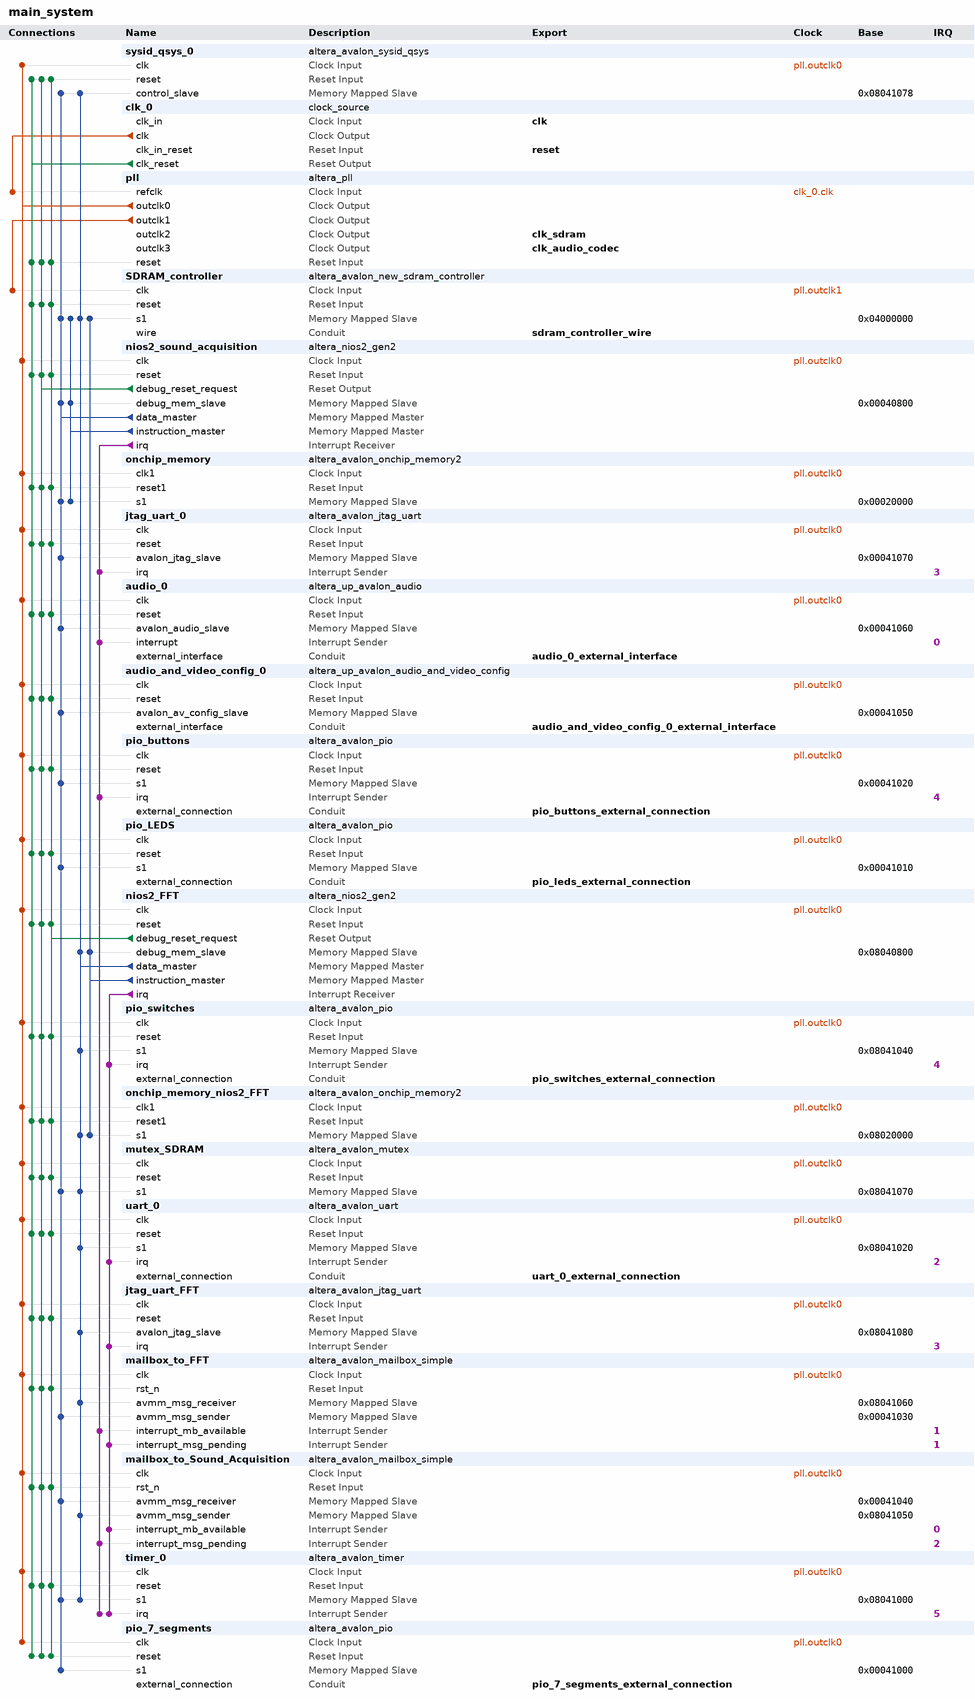
[diagram p0: system contents]
# Platform Designer (Qsys) system main_system, Cyclone V 5CSEMA5F31C6
# Parameters at their usual value, and those the tool derives, are not listed.
package require -exact qsys 18.0
create_system main_system
set_project_property DEVICE_FAMILY {Cyclone V}
set_project_property DEVICE 5CSEMA5F31C6

add_instance sysid_qsys_0 altera_avalon_sysid_qsys 18.0
set_instance_parameter_value sysid_qsys_0 id 0

add_instance clk_0 clock_source 18.0
set_instance_parameter_value clk_0 clockFrequency 50000000

add_instance pll altera_pll 18.0
set_instance_parameter_value pll gui_device_speed_grade 1
set_instance_parameter_value pll gui_number_of_clocks 4
set_instance_parameter_value pll gui_operation_mode normal
set_instance_parameter_value pll gui_output_clock_frequency0 50.0
set_instance_parameter_value pll gui_output_clock_frequency1 100.0
set_instance_parameter_value pll gui_output_clock_frequency2 100.0
set_instance_parameter_value pll gui_output_clock_frequency3 12.288
set_instance_parameter_value pll gui_phase_shift2 -3758
set_instance_parameter_value pll gui_pll_mode {Integer-N PLL}
set_instance_parameter_value pll gui_reference_clock_frequency 50.0
set_instance_parameter_value pll gui_use_locked false

add_instance SDRAM_controller altera_avalon_new_sdram_controller 18.0
set_instance_parameter_value SDRAM_controller TAC 5.4
set_instance_parameter_value SDRAM_controller TRCD 15.0
set_instance_parameter_value SDRAM_controller TRP 15.0
set_instance_parameter_value SDRAM_controller casLatency 3
set_instance_parameter_value SDRAM_controller columnWidth 10
set_instance_parameter_value SDRAM_controller dataWidth 16
set_instance_parameter_value SDRAM_controller generateSimulationModel false
set_instance_parameter_value SDRAM_controller model single_Micron_MT48LC4M32B2_7_chip
set_instance_parameter_value SDRAM_controller numberOfBanks 4
set_instance_parameter_value SDRAM_controller numberOfChipSelects 1
set_instance_parameter_value SDRAM_controller powerUpDelay 100.0
set_instance_parameter_value SDRAM_controller refreshPeriod 7.8125
set_instance_parameter_value SDRAM_controller rowWidth 13

add_instance nios2_sound_acquisition altera_nios2_gen2 18.0
set_instance_parameter_value nios2_sound_acquisition dcache_size 2048
set_instance_parameter_value nios2_sound_acquisition exceptionSlave onchip_memory.s1
set_instance_parameter_value nios2_sound_acquisition icache_size 4096
set_instance_parameter_value nios2_sound_acquisition impl Fast
set_instance_parameter_value nios2_sound_acquisition resetSlave onchip_memory.s1

add_instance onchip_memory altera_avalon_onchip_memory2 18.0
set_instance_parameter_value onchip_memory dataWidth 32
set_instance_parameter_value onchip_memory dualPort false
set_instance_parameter_value onchip_memory initMemContent true
set_instance_parameter_value onchip_memory initializationFileName onchip_mem.hex
set_instance_parameter_value onchip_memory memorySize 131072

add_instance jtag_uart_0 altera_avalon_jtag_uart 18.0
set_instance_parameter_value jtag_uart_0 simInteractiveOptions NO_INTERACTIVE_WINDOWS

add_instance audio_0 altera_up_avalon_audio 18.0
set_instance_parameter_value audio_0 audio_in true
set_instance_parameter_value audio_0 avalon_bus_type {Memory Mapped}
set_instance_parameter_value audio_0 dw 32

add_instance audio_and_video_config_0 altera_up_avalon_audio_and_video_config 18.0
set_instance_parameter_value audio_and_video_config_0 audio_in {Microphone to ADC}
set_instance_parameter_value audio_and_video_config_0 bit_length 32
set_instance_parameter_value audio_and_video_config_0 board DE1-SoC
set_instance_parameter_value audio_and_video_config_0 line_in_bypass false
set_instance_parameter_value audio_and_video_config_0 sampling_rate {48 kHz}

add_instance pio_buttons altera_avalon_pio 18.0
set_instance_parameter_value pio_buttons captureEdge true
set_instance_parameter_value pio_buttons direction Input
set_instance_parameter_value pio_buttons edgeType ANY
set_instance_parameter_value pio_buttons generateIRQ true
set_instance_parameter_value pio_buttons irqType EDGE
set_instance_parameter_value pio_buttons width 4

add_instance pio_LEDS altera_avalon_pio 18.0
set_instance_parameter_value pio_LEDS direction Output
set_instance_parameter_value pio_LEDS width 10

add_instance nios2_FFT altera_nios2_gen2 18.0
set_instance_parameter_value nios2_FFT dcache_size 2048
set_instance_parameter_value nios2_FFT exceptionSlave onchip_memory_nios2_FFT.s1
set_instance_parameter_value nios2_FFT icache_size 4096
set_instance_parameter_value nios2_FFT impl Fast
set_instance_parameter_value nios2_FFT resetSlave onchip_memory_nios2_FFT.s1

add_instance pio_switches altera_avalon_pio 18.0
set_instance_parameter_value pio_switches captureEdge true
set_instance_parameter_value pio_switches direction Input
set_instance_parameter_value pio_switches edgeType ANY
set_instance_parameter_value pio_switches generateIRQ true
set_instance_parameter_value pio_switches irqType EDGE
set_instance_parameter_value pio_switches width 10

add_instance onchip_memory_nios2_FFT altera_avalon_onchip_memory2 18.0
set_instance_parameter_value onchip_memory_nios2_FFT dataWidth 32
set_instance_parameter_value onchip_memory_nios2_FFT dualPort false
set_instance_parameter_value onchip_memory_nios2_FFT initMemContent true
set_instance_parameter_value onchip_memory_nios2_FFT initializationFileName onchip_mem.hex
set_instance_parameter_value onchip_memory_nios2_FFT memorySize 131072

add_instance mutex_SDRAM altera_avalon_mutex 18.0

add_instance uart_0 altera_avalon_uart 18.0
set_instance_parameter_value uart_0 baud 115200
set_instance_parameter_value uart_0 dataBits 8
set_instance_parameter_value uart_0 fixedBaud true
set_instance_parameter_value uart_0 parity NONE
set_instance_parameter_value uart_0 stopBits 1

add_instance jtag_uart_FFT altera_avalon_jtag_uart 18.0
set_instance_parameter_value jtag_uart_FFT simInteractiveOptions NO_INTERACTIVE_WINDOWS

add_instance mailbox_to_FFT altera_avalon_mailbox_simple 18.0
set_instance_parameter_value mailbox_to_FFT AWIDTH 2
set_instance_parameter_value mailbox_to_FFT DWIDTH 32
set_instance_parameter_value mailbox_to_FFT MSG_ARRIVAL_NOTIFY 1
set_instance_parameter_value mailbox_to_FFT MSG_SPACE_NOTIFY 1

add_instance mailbox_to_Sound_Acquisition altera_avalon_mailbox_simple 18.0
set_instance_parameter_value mailbox_to_Sound_Acquisition AWIDTH 2
set_instance_parameter_value mailbox_to_Sound_Acquisition DWIDTH 32
set_instance_parameter_value mailbox_to_Sound_Acquisition MSG_ARRIVAL_NOTIFY 1
set_instance_parameter_value mailbox_to_Sound_Acquisition MSG_SPACE_NOTIFY 1

add_instance timer_0 altera_avalon_timer 18.0
set_instance_parameter_value timer_0 period 1
set_instance_parameter_value timer_0 periodUnits MSEC

add_instance pio_7_segments altera_avalon_pio 18.0
set_instance_parameter_value pio_7_segments direction Output
set_instance_parameter_value pio_7_segments width 28

# connections
add_connection clk_0.clk pll.refclk clock
add_connection pll.outclk0 audio_0.clk clock
add_connection pll.outclk0 audio_and_video_config_0.clk clock
add_connection pll.outclk0 jtag_uart_0.clk clock
add_connection pll.outclk0 jtag_uart_FFT.clk clock
add_connection pll.outclk0 mailbox_to_FFT.clk clock
add_connection pll.outclk0 mailbox_to_Sound_Acquisition.clk clock
add_connection pll.outclk0 mutex_SDRAM.clk clock
add_connection pll.outclk0 nios2_FFT.clk clock
add_connection pll.outclk0 nios2_sound_acquisition.clk clock
add_connection pll.outclk0 onchip_memory.clk1 clock
add_connection pll.outclk0 onchip_memory_nios2_FFT.clk1 clock
add_connection pll.outclk0 pio_7_segments.clk clock
add_connection pll.outclk0 pio_buttons.clk clock
add_connection pll.outclk0 pio_LEDS.clk clock
add_connection pll.outclk0 pio_switches.clk clock
add_connection pll.outclk0 sysid_qsys_0.clk clock
add_connection pll.outclk0 timer_0.clk clock
add_connection pll.outclk0 uart_0.clk clock
add_connection pll.outclk1 SDRAM_controller.clk clock
add_connection clk_0.clk_reset audio_0.reset reset
add_connection clk_0.clk_reset audio_and_video_config_0.reset reset
add_connection clk_0.clk_reset jtag_uart_0.reset reset
add_connection clk_0.clk_reset jtag_uart_FFT.reset reset
add_connection clk_0.clk_reset mailbox_to_FFT.rst_n reset
add_connection clk_0.clk_reset mailbox_to_Sound_Acquisition.rst_n reset
add_connection clk_0.clk_reset mutex_SDRAM.reset reset
add_connection clk_0.clk_reset nios2_FFT.reset reset
add_connection clk_0.clk_reset nios2_sound_acquisition.reset reset
add_connection clk_0.clk_reset onchip_memory.reset1 reset
add_connection clk_0.clk_reset onchip_memory_nios2_FFT.reset1 reset
add_connection clk_0.clk_reset pio_7_segments.reset reset
add_connection clk_0.clk_reset pio_buttons.reset reset
add_connection clk_0.clk_reset pio_LEDS.reset reset
add_connection clk_0.clk_reset pio_switches.reset reset
add_connection clk_0.clk_reset pll.reset reset
add_connection clk_0.clk_reset SDRAM_controller.reset reset
add_connection clk_0.clk_reset sysid_qsys_0.reset reset
add_connection clk_0.clk_reset timer_0.reset reset
add_connection clk_0.clk_reset uart_0.reset reset
add_connection nios2_FFT.debug_reset_request audio_0.reset reset
add_connection nios2_FFT.debug_reset_request audio_and_video_config_0.reset reset
add_connection nios2_FFT.debug_reset_request jtag_uart_0.reset reset
add_connection nios2_FFT.debug_reset_request jtag_uart_FFT.reset reset
add_connection nios2_FFT.debug_reset_request mailbox_to_FFT.rst_n reset
add_connection nios2_FFT.debug_reset_request mailbox_to_Sound_Acquisition.rst_n reset
add_connection nios2_FFT.debug_reset_request mutex_SDRAM.reset reset
add_connection nios2_FFT.debug_reset_request nios2_FFT.reset reset
add_connection nios2_FFT.debug_reset_request nios2_sound_acquisition.reset reset
add_connection nios2_FFT.debug_reset_request onchip_memory.reset1 reset
add_connection nios2_FFT.debug_reset_request onchip_memory_nios2_FFT.reset1 reset
add_connection nios2_FFT.debug_reset_request pio_7_segments.reset reset
add_connection nios2_FFT.debug_reset_request pio_buttons.reset reset
add_connection nios2_FFT.debug_reset_request pio_LEDS.reset reset
add_connection nios2_FFT.debug_reset_request pio_switches.reset reset
add_connection nios2_FFT.debug_reset_request pll.reset reset
add_connection nios2_FFT.debug_reset_request SDRAM_controller.reset reset
add_connection nios2_FFT.debug_reset_request sysid_qsys_0.reset reset
add_connection nios2_FFT.debug_reset_request timer_0.reset reset
add_connection nios2_FFT.debug_reset_request uart_0.reset reset
add_connection nios2_sound_acquisition.debug_reset_request audio_0.reset reset
add_connection nios2_sound_acquisition.debug_reset_request audio_and_video_config_0.reset reset
add_connection nios2_sound_acquisition.debug_reset_request jtag_uart_0.reset reset
add_connection nios2_sound_acquisition.debug_reset_request jtag_uart_FFT.reset reset
add_connection nios2_sound_acquisition.debug_reset_request mailbox_to_FFT.rst_n reset
add_connection nios2_sound_acquisition.debug_reset_request mailbox_to_Sound_Acquisition.rst_n reset
add_connection nios2_sound_acquisition.debug_reset_request mutex_SDRAM.reset reset
add_connection nios2_sound_acquisition.debug_reset_request nios2_FFT.reset reset
add_connection nios2_sound_acquisition.debug_reset_request nios2_sound_acquisition.reset reset
add_connection nios2_sound_acquisition.debug_reset_request onchip_memory.reset1 reset
add_connection nios2_sound_acquisition.debug_reset_request onchip_memory_nios2_FFT.reset1 reset
add_connection nios2_sound_acquisition.debug_reset_request pio_7_segments.reset reset
add_connection nios2_sound_acquisition.debug_reset_request pio_buttons.reset reset
add_connection nios2_sound_acquisition.debug_reset_request pio_LEDS.reset reset
add_connection nios2_sound_acquisition.debug_reset_request pio_switches.reset reset
add_connection nios2_sound_acquisition.debug_reset_request pll.reset reset
add_connection nios2_sound_acquisition.debug_reset_request SDRAM_controller.reset reset
add_connection nios2_sound_acquisition.debug_reset_request sysid_qsys_0.reset reset
add_connection nios2_sound_acquisition.debug_reset_request timer_0.reset reset
add_connection nios2_sound_acquisition.debug_reset_request uart_0.reset reset
add_connection nios2_FFT.data_master jtag_uart_FFT.avalon_jtag_slave avalon
set_connection_parameter_value nios2_FFT.data_master/jtag_uart_FFT.avalon_jtag_slave baseAddress 0x08041080
add_connection nios2_FFT.data_master mailbox_to_FFT.avmm_msg_receiver avalon
set_connection_parameter_value nios2_FFT.data_master/mailbox_to_FFT.avmm_msg_receiver baseAddress 0x08041060
add_connection nios2_FFT.data_master mailbox_to_Sound_Acquisition.avmm_msg_sender avalon
set_connection_parameter_value nios2_FFT.data_master/mailbox_to_Sound_Acquisition.avmm_msg_sender baseAddress 0x08041050
add_connection nios2_FFT.data_master mutex_SDRAM.s1 avalon
set_connection_parameter_value nios2_FFT.data_master/mutex_SDRAM.s1 baseAddress 0x08041070
add_connection nios2_FFT.data_master nios2_FFT.debug_mem_slave avalon
set_connection_parameter_value nios2_FFT.data_master/nios2_FFT.debug_mem_slave baseAddress 0x08040800
add_connection nios2_FFT.data_master onchip_memory_nios2_FFT.s1 avalon
set_connection_parameter_value nios2_FFT.data_master/onchip_memory_nios2_FFT.s1 baseAddress 0x08020000
add_connection nios2_FFT.data_master pio_switches.s1 avalon
set_connection_parameter_value nios2_FFT.data_master/pio_switches.s1 baseAddress 0x08041040
add_connection nios2_FFT.data_master SDRAM_controller.s1 avalon
set_connection_parameter_value nios2_FFT.data_master/SDRAM_controller.s1 baseAddress 0x04000000
add_connection nios2_FFT.data_master sysid_qsys_0.control_slave avalon
set_connection_parameter_value nios2_FFT.data_master/sysid_qsys_0.control_slave baseAddress 0x08041078
add_connection nios2_FFT.data_master timer_0.s1 avalon
set_connection_parameter_value nios2_FFT.data_master/timer_0.s1 baseAddress 0x08041000
add_connection nios2_FFT.data_master uart_0.s1 avalon
set_connection_parameter_value nios2_FFT.data_master/uart_0.s1 baseAddress 0x08041020
add_connection nios2_FFT.instruction_master nios2_FFT.debug_mem_slave avalon
set_connection_parameter_value nios2_FFT.instruction_master/nios2_FFT.debug_mem_slave baseAddress 0x08040800
add_connection nios2_FFT.instruction_master onchip_memory_nios2_FFT.s1 avalon
set_connection_parameter_value nios2_FFT.instruction_master/onchip_memory_nios2_FFT.s1 baseAddress 0x08020000
add_connection nios2_FFT.instruction_master SDRAM_controller.s1 avalon
set_connection_parameter_value nios2_FFT.instruction_master/SDRAM_controller.s1 baseAddress 0x04000000
add_connection nios2_sound_acquisition.data_master audio_0.avalon_audio_slave avalon
set_connection_parameter_value nios2_sound_acquisition.data_master/audio_0.avalon_audio_slave baseAddress 0x00041060
add_connection nios2_sound_acquisition.data_master audio_and_video_config_0.avalon_av_config_slave avalon
set_connection_parameter_value nios2_sound_acquisition.data_master/audio_and_video_config_0.avalon_av_config_slave baseAddress 0x00041050
add_connection nios2_sound_acquisition.data_master jtag_uart_0.avalon_jtag_slave avalon
set_connection_parameter_value nios2_sound_acquisition.data_master/jtag_uart_0.avalon_jtag_slave baseAddress 0x00041070
add_connection nios2_sound_acquisition.data_master mailbox_to_FFT.avmm_msg_sender avalon
set_connection_parameter_value nios2_sound_acquisition.data_master/mailbox_to_FFT.avmm_msg_sender baseAddress 0x00041030
add_connection nios2_sound_acquisition.data_master mailbox_to_Sound_Acquisition.avmm_msg_receiver avalon
set_connection_parameter_value nios2_sound_acquisition.data_master/mailbox_to_Sound_Acquisition.avmm_msg_receiver baseAddress 0x00041040
add_connection nios2_sound_acquisition.data_master mutex_SDRAM.s1 avalon
set_connection_parameter_value nios2_sound_acquisition.data_master/mutex_SDRAM.s1 baseAddress 0x08041070
add_connection nios2_sound_acquisition.data_master nios2_sound_acquisition.debug_mem_slave avalon
set_connection_parameter_value nios2_sound_acquisition.data_master/nios2_sound_acquisition.debug_mem_slave baseAddress 0x00040800
add_connection nios2_sound_acquisition.data_master onchip_memory.s1 avalon
set_connection_parameter_value nios2_sound_acquisition.data_master/onchip_memory.s1 baseAddress 0x00020000
add_connection nios2_sound_acquisition.data_master pio_7_segments.s1 avalon
set_connection_parameter_value nios2_sound_acquisition.data_master/pio_7_segments.s1 baseAddress 0x00041000
add_connection nios2_sound_acquisition.data_master pio_buttons.s1 avalon
set_connection_parameter_value nios2_sound_acquisition.data_master/pio_buttons.s1 baseAddress 0x00041020
add_connection nios2_sound_acquisition.data_master pio_LEDS.s1 avalon
set_connection_parameter_value nios2_sound_acquisition.data_master/pio_LEDS.s1 baseAddress 0x00041010
add_connection nios2_sound_acquisition.data_master SDRAM_controller.s1 avalon
set_connection_parameter_value nios2_sound_acquisition.data_master/SDRAM_controller.s1 baseAddress 0x04000000
add_connection nios2_sound_acquisition.data_master sysid_qsys_0.control_slave avalon
set_connection_parameter_value nios2_sound_acquisition.data_master/sysid_qsys_0.control_slave baseAddress 0x08041078
add_connection nios2_sound_acquisition.data_master timer_0.s1 avalon
set_connection_parameter_value nios2_sound_acquisition.data_master/timer_0.s1 baseAddress 0x08041000
add_connection nios2_sound_acquisition.instruction_master nios2_sound_acquisition.debug_mem_slave avalon
set_connection_parameter_value nios2_sound_acquisition.instruction_master/nios2_sound_acquisition.debug_mem_slave baseAddress 0x00040800
add_connection nios2_sound_acquisition.instruction_master onchip_memory.s1 avalon
set_connection_parameter_value nios2_sound_acquisition.instruction_master/onchip_memory.s1 baseAddress 0x00020000
add_connection nios2_sound_acquisition.instruction_master SDRAM_controller.s1 avalon
set_connection_parameter_value nios2_sound_acquisition.instruction_master/SDRAM_controller.s1 baseAddress 0x04000000
add_connection nios2_FFT.irq jtag_uart_FFT.irq interrupt
set_connection_parameter_value nios2_FFT.irq/jtag_uart_FFT.irq irqNumber 3
add_connection nios2_FFT.irq mailbox_to_FFT.interrupt_msg_pending interrupt
set_connection_parameter_value nios2_FFT.irq/mailbox_to_FFT.interrupt_msg_pending irqNumber 1
add_connection nios2_FFT.irq mailbox_to_Sound_Acquisition.interrupt_mb_available interrupt
set_connection_parameter_value nios2_FFT.irq/mailbox_to_Sound_Acquisition.interrupt_mb_available irqNumber 0
add_connection nios2_FFT.irq pio_switches.irq interrupt
set_connection_parameter_value nios2_FFT.irq/pio_switches.irq irqNumber 4
add_connection nios2_FFT.irq timer_0.irq interrupt
set_connection_parameter_value nios2_FFT.irq/timer_0.irq irqNumber 5
add_connection nios2_FFT.irq uart_0.irq interrupt
set_connection_parameter_value nios2_FFT.irq/uart_0.irq irqNumber 2
add_connection nios2_sound_acquisition.irq audio_0.interrupt interrupt
set_connection_parameter_value nios2_sound_acquisition.irq/audio_0.interrupt irqNumber 0
add_connection nios2_sound_acquisition.irq jtag_uart_0.irq interrupt
set_connection_parameter_value nios2_sound_acquisition.irq/jtag_uart_0.irq irqNumber 3
add_connection nios2_sound_acquisition.irq mailbox_to_FFT.interrupt_mb_available interrupt
set_connection_parameter_value nios2_sound_acquisition.irq/mailbox_to_FFT.interrupt_mb_available irqNumber 1
add_connection nios2_sound_acquisition.irq mailbox_to_Sound_Acquisition.interrupt_msg_pending interrupt
set_connection_parameter_value nios2_sound_acquisition.irq/mailbox_to_Sound_Acquisition.interrupt_msg_pending irqNumber 2
add_connection nios2_sound_acquisition.irq pio_buttons.irq interrupt
set_connection_parameter_value nios2_sound_acquisition.irq/pio_buttons.irq irqNumber 4
add_connection nios2_sound_acquisition.irq timer_0.irq interrupt
set_connection_parameter_value nios2_sound_acquisition.irq/timer_0.irq irqNumber 5

# exported interfaces
add_interface audio_0_external_interface conduit end
set_interface_property audio_0_external_interface EXPORT_OF audio_0.external_interface
add_interface audio_and_video_config_0_external_interface conduit end
set_interface_property audio_and_video_config_0_external_interface EXPORT_OF audio_and_video_config_0.external_interface
add_interface clk clock sink
set_interface_property clk EXPORT_OF clk_0.clk_in
add_interface clk_audio_codec clock source
set_interface_property clk_audio_codec EXPORT_OF pll.outclk3
add_interface clk_sdram clock source
set_interface_property clk_sdram EXPORT_OF pll.outclk2
add_interface pio_7_segments_external_connection conduit end
set_interface_property pio_7_segments_external_connection EXPORT_OF pio_7_segments.external_connection
add_interface pio_buttons_external_connection conduit end
set_interface_property pio_buttons_external_connection EXPORT_OF pio_buttons.external_connection
add_interface pio_leds_external_connection conduit end
set_interface_property pio_leds_external_connection EXPORT_OF pio_LEDS.external_connection
add_interface pio_switches_external_connection conduit end
set_interface_property pio_switches_external_connection EXPORT_OF pio_switches.external_connection
add_interface reset reset sink
set_interface_property reset EXPORT_OF clk_0.clk_in_reset
add_interface sdram_controller_wire conduit end
set_interface_property sdram_controller_wire EXPORT_OF SDRAM_controller.wire
add_interface uart_0_external_connection conduit end
set_interface_property uart_0_external_connection EXPORT_OF uart_0.external_connection

set_interconnect_requirement {$system} qsys_mm.clockCrossingAdapter HANDSHAKE
set_interconnect_requirement {$system} qsys_mm.enableEccProtection FALSE
set_interconnect_requirement {$system} qsys_mm.insertDefaultSlave FALSE
set_interconnect_requirement {$system} qsys_mm.maxAdditionalLatency 1

save_system main_system.qsys
